# Altium schematic sheet MEMORY.schdoc
size D; SheetNumber: 6; SheetTotal: 8
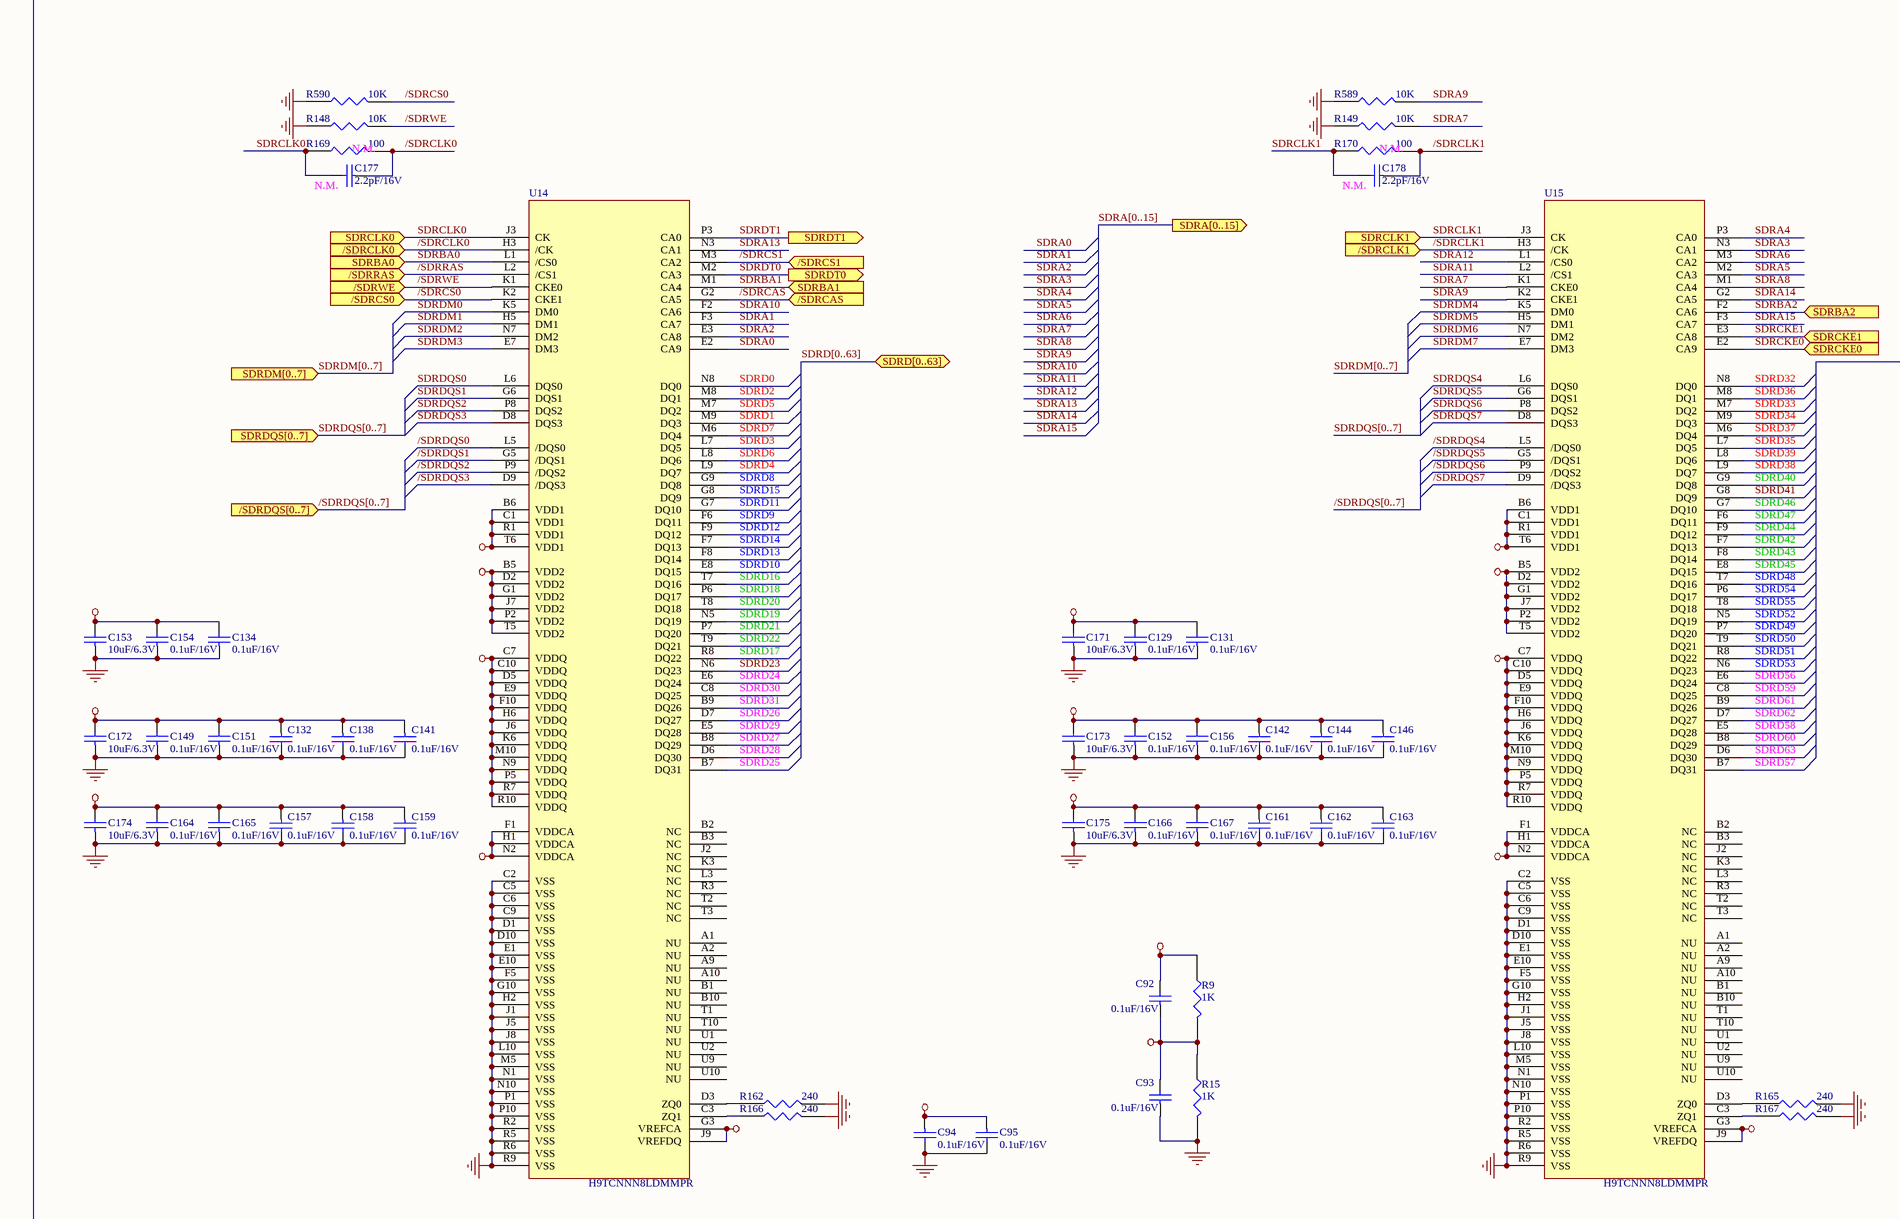
[diagram p0: MEMORY.schdoc, top left]
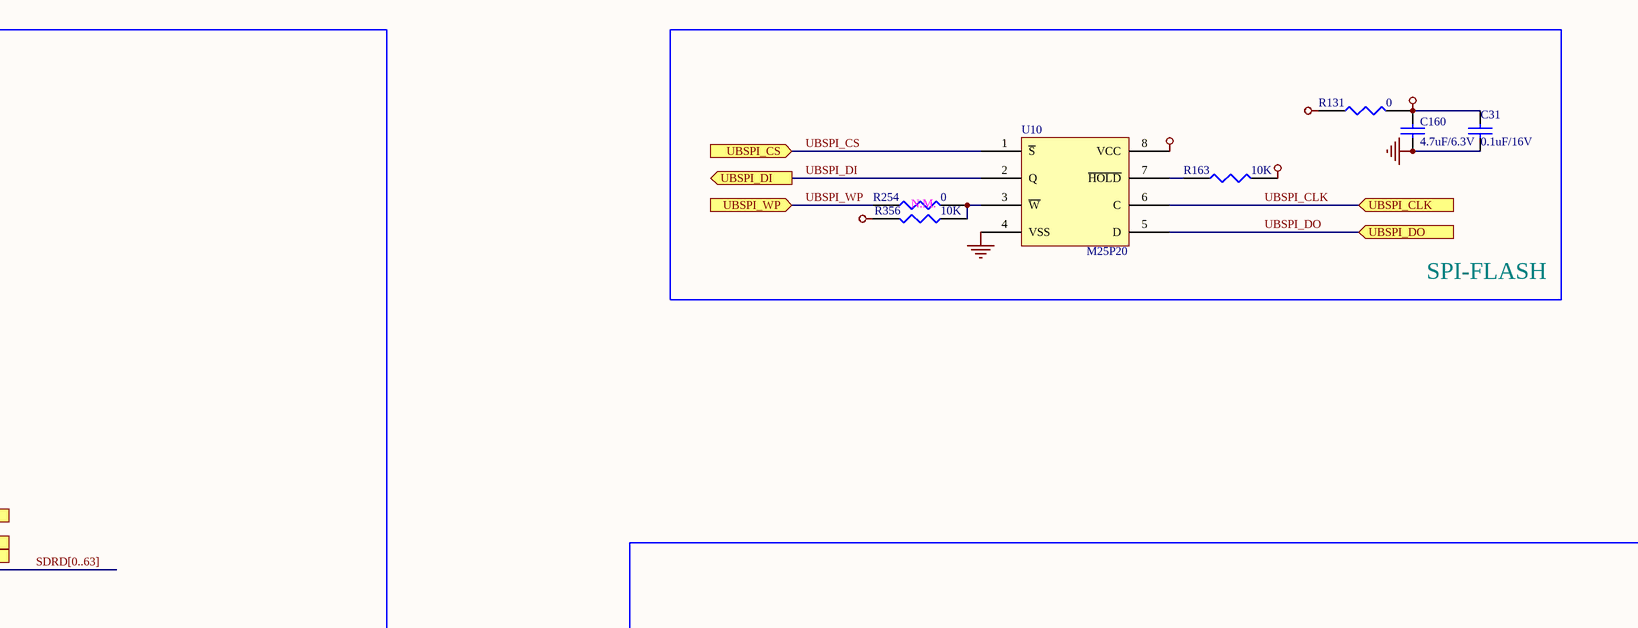
[diagram p1: MEMORY.schdoc, top right]
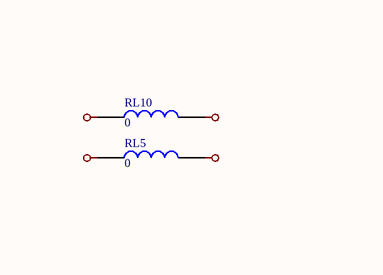
[diagram p2: MEMORY.schdoc, bottom left]
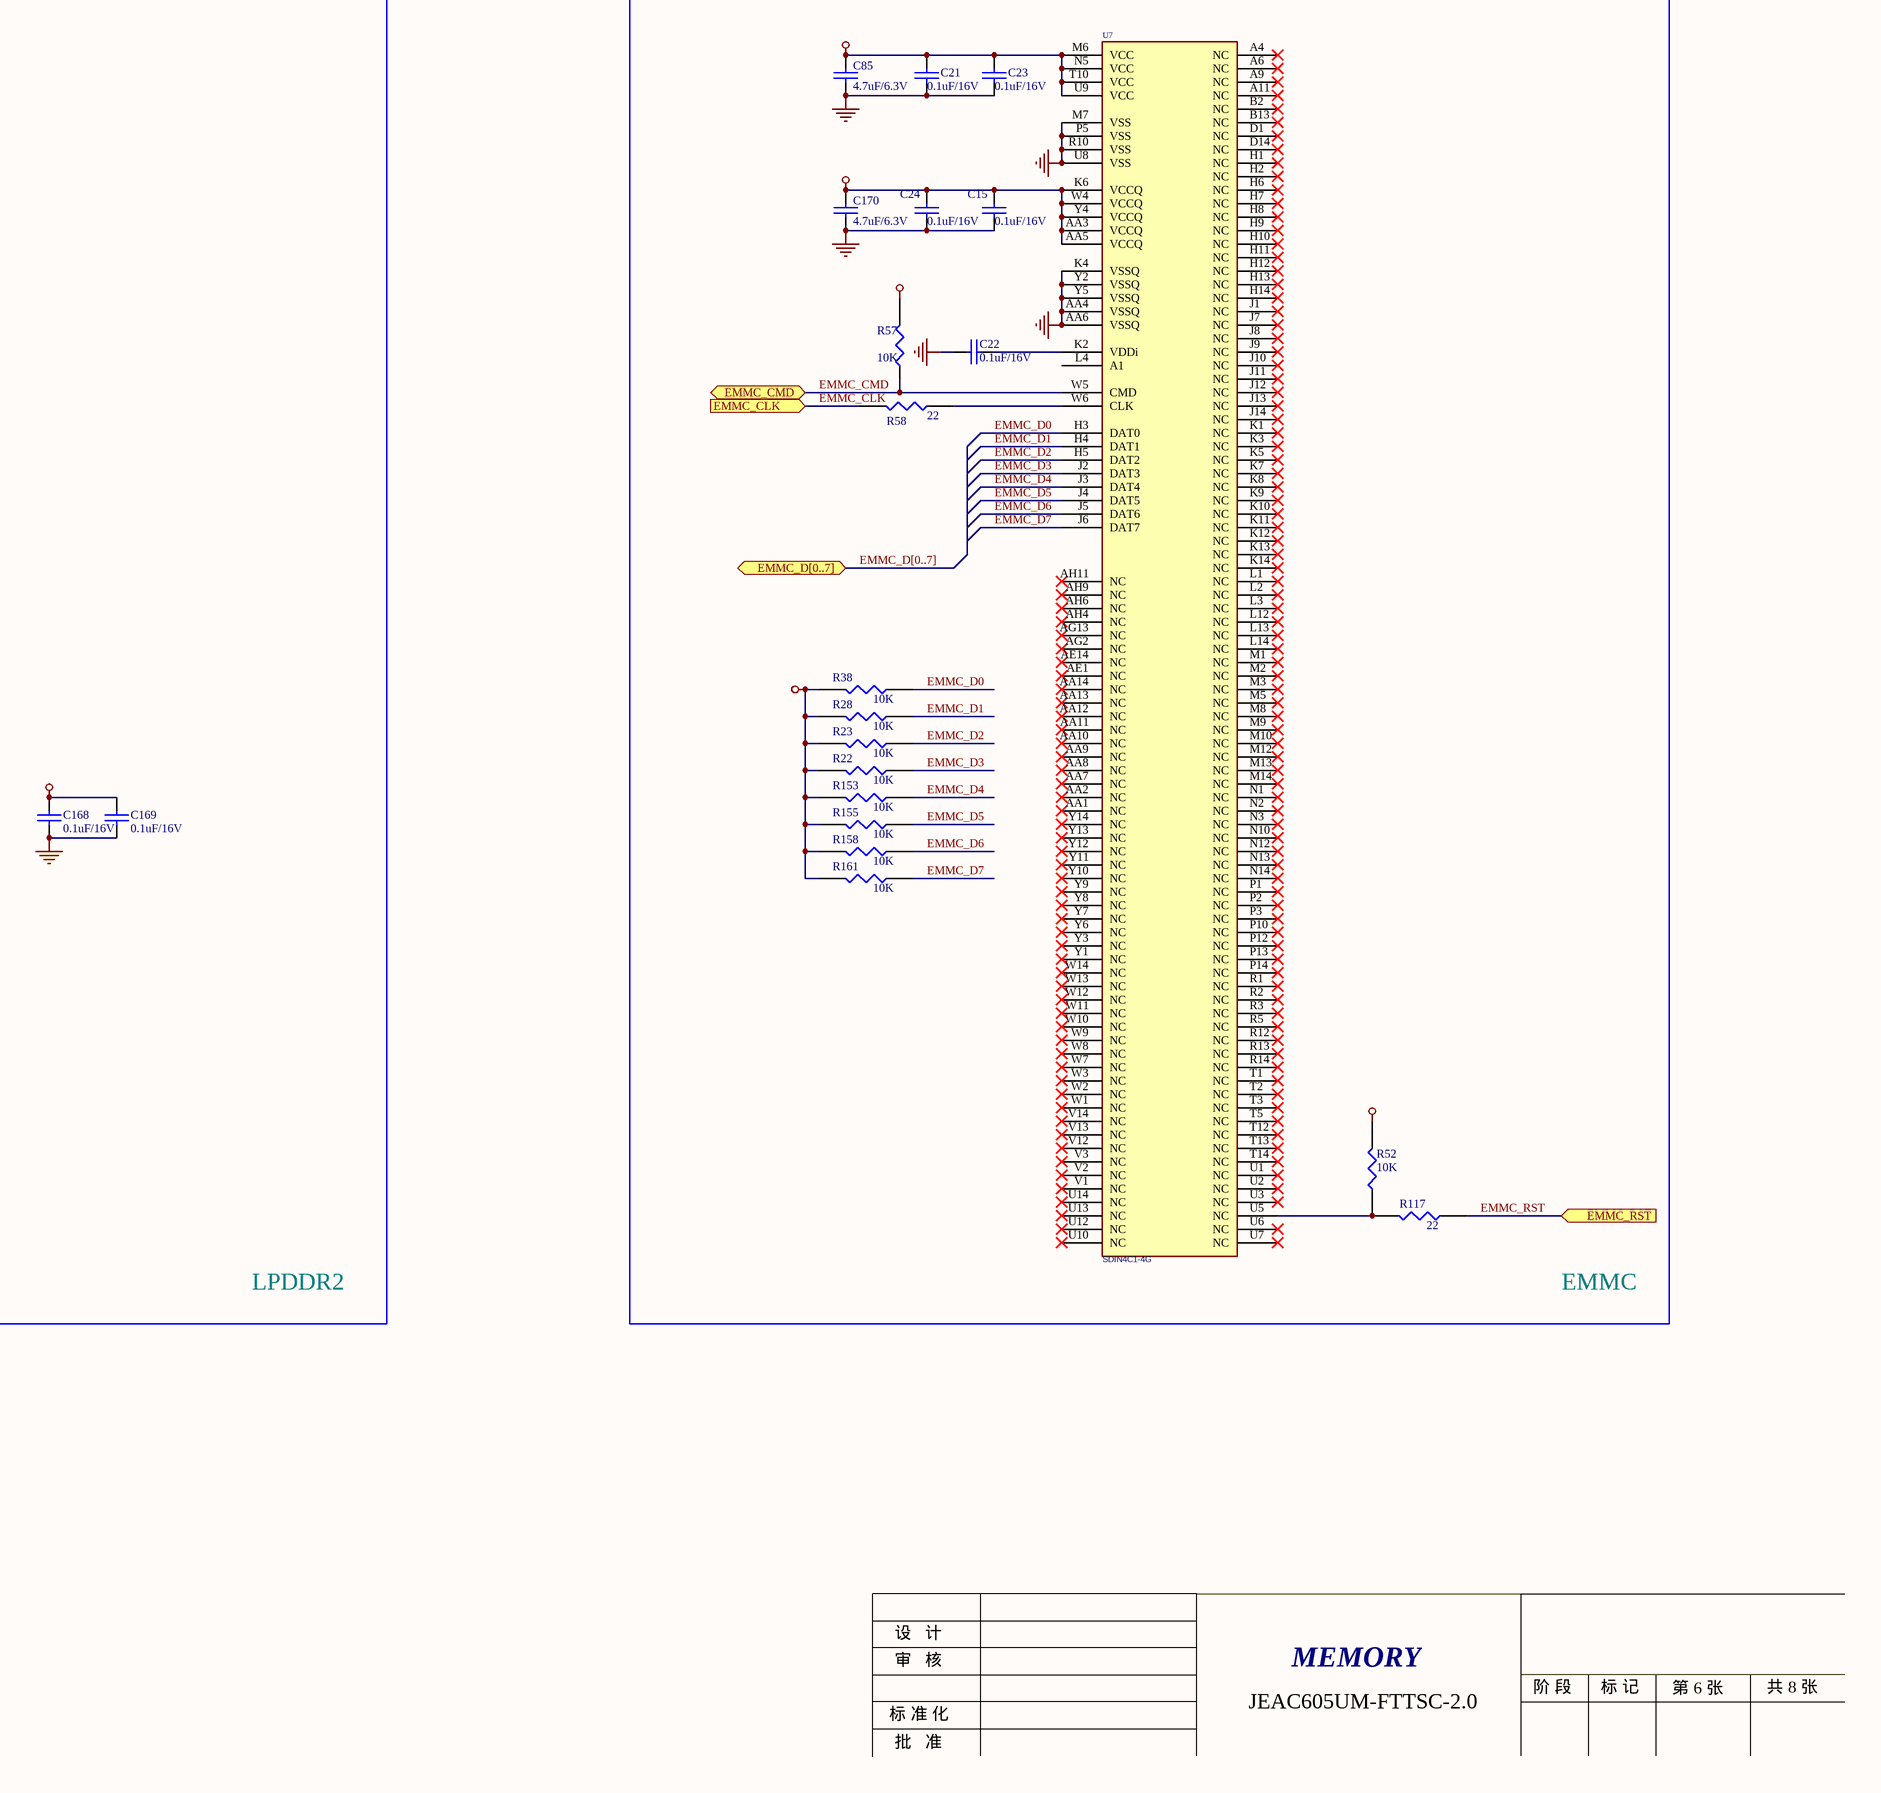
[diagram p3: MEMORY.schdoc, bottom right]

## Parts
C15  0.1uF/16V  [C0402]
C21  0.1uF/16V  [C0402]
C22  0.1uF/16V  [C0402]
C23  0.1uF/16V  [C0402]
C24  0.1uF/16V  [C0402]
C31  0.1uF/16V  [C0402]
C85  4.7uF/6.3V  [C0603]
C92  0.1uF/16V  [C0402]
C93  0.1uF/16V  [C0402]
C94  0.1uF/16V  [C0402]
C95  0.1uF/16V  [C0402]
C129  0.1uF/16V  [C0402]
C131  0.1uF/16V  [C0402]
C132  0.1uF/16V  [C0402]
C134  0.1uF/16V  [C0402]
C138  0.1uF/16V  [C0402]
C141  0.1uF/16V  [C0402]
C142  0.1uF/16V  [C0402]
C144  0.1uF/16V  [C0402]
C146  0.1uF/16V  [C0402]
C149  0.1uF/16V  [C0402]
C151  0.1uF/16V  [C0402]
C152  0.1uF/16V  [C0402]
C153  10uF/6.3V  [C0603]
C154  0.1uF/16V  [C0402]
C156  0.1uF/16V  [C0402]
C157  0.1uF/16V  [C0402]
C158  0.1uF/16V  [C0402]
C159  0.1uF/16V  [C0402]
C160  4.7uF/6.3V  [C0603]
C161  0.1uF/16V  [C0402]
C162  0.1uF/16V  [C0402]
C163  0.1uF/16V  [C0402]
C164  0.1uF/16V  [C0402]
C165  0.1uF/16V  [C0402]
C166  0.1uF/16V  [C0402]
C167  0.1uF/16V  [C0402]
C168  0.1uF/16V  [C0402]
C169  0.1uF/16V  [C0402]
C170  4.7uF/6.3V  [C0603]
C171  10uF/6.3V  [C0603]
C172  10uF/6.3V  [C0603]
C173  10uF/6.3V  [C0603]
C174  10uF/6.3V  [C0603]
C175  10uF/6.3V  [C0603]
C177  2.2pF/16V  [C0402]
C178  2.2pF/16V  [C0402]
R9  1K  [R0402]
R15  1K  [R0402]
R22  10K  [R0402]
R23  10K  [R0402]
R28  10K  [R0402]
R38  10K  [R0402]
R52  10K  [R0402]
R57  10K  [R0402]
R58  22  [R0402]
R117  22  [R0402]
R131  0  [R0402]
R148  10K  [R0402]
R149  10K  [R0402]
R153  10K  [R0402]
R155  10K  [R0402]
R158  10K  [R0402]
R161  10K  [R0402]
R162  240  [R0402]
R163  10K  [R0402]
R165  240  [R0402]
R166  240  [R0402]
R167  240  [R0402]
R169  100  [R0402]
R170  100  [R0402]
R254  0  [R0402]
R356  10K  [R0402]
R589  10K  [R0402]
R590  10K  [R0402]
RL5  0  [L0603]
RL10  0  [L0603]
U7  SDIN4C1-4G  [U-FBGA-169-0_5]
U10  M25P20  [U-SO-8-1_27]
U14  H9TCNNN8LDMMPR  [U-FBGA-134-0_65]
U15  H9TCNNN8LDMMPR  [U-FBGA-134-0_65]

## Blocks framed on the sheet
LPDDR2: C92-C95 C129 C131 C132 C134 C138 C141 C142 C144 C146 C149 C151-C154 C156-C159 C161-C169 C171-C175 C177 C178 R9 R15 R148 R149 R162 R165-R167 R169 R170 R589 R590 RL5 RL10 U14 U15
SPI-FLASH: C31 C160 R131 R163 R254 R356 U10
EMMC: C15 C21-C24 C85 C170 R22 R23 R28 R38 R52 R57 R58 R117 R153 R155 R158 R161 U7

## Ports
/SDRCAS (in), /SDRCLK0 (in), /SDRCLK1 (in), /SDRCS0 (in), /SDRCS1 (in), /SDRDQS[0..7] (in), /SDRRAS (in), /SDRWE (in), EMMC_CLK (in), EMMC_CMD (bidir), EMMC_D[0..7] (bidir), EMMC_RST (in), SDRA[0..15] (out), SDRBA0 (in), SDRBA1 (in), SDRBA2 (in), SDRCKE0 (in), SDRCKE1 (in), SDRCLK0 (in), SDRCLK1 (in), SDRD[0..63] (bidir), SDRDM[0..7] (in), SDRDQS[0..7] (in), SDRDT0 (out), SDRDT1 (out), UBSPI_CLK (in), UBSPI_CS (in), UBSPI_DI (out), UBSPI_DO (in), UBSPI_WP (in)

## Nets
DRAM_VREF: C92.1 C93.2 C94.1 C95.1 C168.1 C169.1 R9.2 R15.1 U14.G3(VREFCA) U14.J9(VREFDQ) U15.G3(VREFCA) U15.J9(VREFDQ)
GND: C15.1 C21.1 C22.1 C23.1 C24.1 C31.1 C85.2 C93.1 C94.2 C95.2 C129.1 C131.1 C132.2 C134.1 C138.2 C141.2 C142.2 C144.2 C146.2 C149.1 C151.1 C152.1 C153.1 C154.1 C156.1 C157.2 C158.2 C159.2 C160.2 C161.2 C162.2 C163.2 C164.1 C165.1 C166.1 C167.1 C168.2 C169.2 C170.2 C171.1 C172.1 C173.1 C174.1 C175.1 R15.2 R148.1 R149.1 R162.2 R165.2 R166.2 R167.2 R589.1 R590.1 U7.AA4(VSSQ) U7.AA6(VSSQ) U7.K4(VSSQ) U7.M7(VSS) U7.P5(VSS) U7.R10(VSS) U7.U8(VSS) U7.Y2(VSSQ) U7.Y5(VSSQ) U10.4(VSS) U14.C2(VSS) U14.C5(VSS) U14.C6(VSS) U14.C9(VSS) U14.D1(VSS) U14.D10(VSS) U14.E1(VSS) U14.E10(VSS) U14.F5(VSS) U14.G10(VSS) U14.H2(VSS) U14.J1(VSS) U14.J5(VSS) U14.J8(VSS) U14.L10(VSS) U14.M5(VSS) U14.N1(VSS) U14.N10(VSS) U14.P1(VSS) U14.P10(VSS) U14.R2(VSS) U14.R5(VSS) U14.R6(VSS) U14.R9(VSS) U15.C2(VSS) U15.C5(VSS) U15.C6(VSS) U15.C9(VSS) U15.D1(VSS) U15.D10(VSS) U15.E1(VSS) U15.E10(VSS) U15.F5(VSS) U15.G10(VSS) U15.H2(VSS) U15.J1(VSS) U15.J5(VSS) U15.J8(VSS) U15.L10(VSS) U15.M5(VSS) U15.N1(VSS) U15.N10(VSS) U15.P1(VSS) U15.P10(VSS) U15.R2(VSS) U15.R5(VSS) U15.R6(VSS) U15.R9(VSS)
VCC_1V8: RL5.2
VCC_3V: C15.2 C21.2 C23.2 C24.2 C85.1 C170.1 R22.2 R23.2 R28.2 R38.2 R52.2 R57.2 R131.1 R153.2 R155.2 R158.2 R161.2 U7.AA3(VCCQ) U7.AA5(VCCQ) U7.K6(VCCQ) U7.M6(VCC) U7.N5(VCC) U7.T10(VCC) U7.U9(VCC) U7.W4(VCCQ) U7.Y4(VCCQ)
VDD_DRAM_1.2V: C92.2 C132.1 C138.1 C141.1 C142.1 C144.1 C146.1 C149.2 C151.2 C152.2 C156.2 C157.1 C158.1 C159.1 C161.1 C162.1 C163.1 C164.2 C165.2 C166.2 C167.2 C172.2 C173.2 C174.2 C175.2 R9.1 RL10.1 U14.B5(VDD2) U14.C7(VDDQ) U14.C10(VDDQ) U14.D2(VDD2) U14.D5(VDDQ) U14.E9(VDDQ) U14.F1(VDDCA) U14.F10(VDDQ) U14.G1(VDD2) U14.H1(VDDCA) U14.H6(VDDQ) U14.J6(VDDQ) U14.J7(VDD2) U14.K6(VDDQ) U14.M10(VDDQ) U14.N2(VDDCA) U14.N9(VDDQ) U14.P2(VDD2) U14.P5(VDDQ) U14.R7(VDDQ) U14.R10(VDDQ) U14.T5(VDD2) U15.B5(VDD2) U15.C7(VDDQ) U15.C10(VDDQ) U15.D2(VDD2) U15.D5(VDDQ) U15.E9(VDDQ) U15.F1(VDDCA) U15.F10(VDDQ) U15.G1(VDD2) U15.H1(VDDCA) U15.H6(VDDQ) U15.J6(VDDQ) U15.J7(VDD2) U15.K6(VDDQ) U15.M10(VDDQ) U15.N2(VDDCA) U15.N9(VDDQ) U15.P2(VDD2) U15.P5(VDDQ) U15.R7(VDDQ) U15.R10(VDDQ) U15.T5(VDD2)
VDD_DRAM_1.8V: C129.2 C131.2 C134.2 C153.2 C154.2 C171.2 RL5.1 U14.B6(VDD1) U14.C1(VDD1) U14.R1(VDD1) U14.T6(VDD1) U15.B6(VDD1) U15.C1(VDD1) U15.R1(VDD1) U15.T6(VDD1)
VDD_SDR_1.2V: RL10.2
VDD_UBSPI: C31.2 C160.1 R131.2 R163.2 R356.2 U10.8(VCC)
/SDRCAS: U14.G2(CA5) ; port /SDRCAS
/SDRCLK0: C177.1 R169.2 U14.H3(/CK) ; port /SDRCLK0
/SDRCLK1: C178.1 R170.2 U15.H3(/CK) ; port /SDRCLK1
/SDRCS0: R590.2 U14.K2(CKE1) ; port /SDRCS0
/SDRCS1: U14.M3(CA2) ; port /SDRCS1
/SDRDQS0: U14.L5(/DQS0)
/SDRDQS1: U14.G5(/DQS1)
/SDRDQS2: U14.P9(/DQS2)
/SDRDQS3: U14.D9(/DQS3)
/SDRDQS4: U15.L5(/DQS0)
/SDRDQS5: U15.G5(/DQS1)
/SDRDQS6: U15.P9(/DQS2)
/SDRDQS7: U15.D9(/DQS3)
/SDRRAS: U14.L2(/CS1) ; port /SDRRAS
/SDRWE: R148.2 U14.K1(CKE0) ; port /SDRWE
EMMC_CLK: R58.2 ; port EMMC_CLK
EMMC_CMD: R57.1 U7.W5(CMD) ; port EMMC_CMD
EMMC_D0: R38.1 U7.H3(DAT0)
EMMC_D1: R28.1 U7.H4(DAT1)
EMMC_D2: R23.1 U7.H5(DAT2)
EMMC_D3: R22.1 U7.J2(DAT3)
EMMC_D4: R153.1 U7.J3(DAT4)
EMMC_D5: R155.1 U7.J4(DAT5)
EMMC_D6: R158.1 U7.J5(DAT6)
EMMC_D7: R161.1 U7.J6(DAT7)
EMMC_RST: R117.1 ; port EMMC_RST
SDRA0: U14.E2(CA9)
SDRA1: U14.F3(CA7)
SDRA2: U14.E3(CA8)
SDRA3: U15.N3(CA1)
SDRA4: U15.P3(CA0)
SDRA5: U15.M2(CA3)
SDRA6: U15.M3(CA2)
SDRA7: R149.2 U15.K1(CKE0)
SDRA8: U15.M1(CA4)
SDRA9: R589.2 U15.K2(CKE1)
SDRA10: U14.F2(CA6)
SDRA11: U15.L2(/CS1)
SDRA12: U15.L1(/CS0)
SDRA13: U14.N3(CA1)
SDRA14: U15.G2(CA5)
SDRA15: U15.F3(CA7)
SDRBA0: U14.L1(/CS0) ; port SDRBA0
SDRBA1: U14.M1(CA4) ; port SDRBA1
SDRBA2: U15.F2(CA6) ; port SDRBA2
SDRCKE0: U15.E2(CA9) ; port SDRCKE0
SDRCKE1: U15.E3(CA8) ; port SDRCKE1
SDRCLK0: C177.2 R169.1 U14.J3(CK) ; port SDRCLK0
SDRCLK1: C178.2 R170.1 U15.J3(CK) ; port SDRCLK1
SDRD0: U14.N8(DQ0)
SDRD1: U14.M9(DQ3)
SDRD2: U14.M8(DQ1)
SDRD3: U14.L7(DQ5)
SDRD4: U14.L9(DQ7)
SDRD5: U14.M7(DQ2)
SDRD6: U14.L8(DQ6)
SDRD7: U14.M6(DQ4)
SDRD8: U14.G9(DQ8)
SDRD9: U14.F6(DQ11)
SDRD10: U14.E8(DQ15)
SDRD11: U14.G7(DQ10)
SDRD12: U14.F9(DQ12)
SDRD13: U14.F8(DQ14)
SDRD14: U14.F7(DQ13)
SDRD15: U14.G8(DQ9)
SDRD16: U14.T7(DQ16)
SDRD17: U14.R8(DQ22)
SDRD18: U14.P6(DQ17)
SDRD19: U14.N5(DQ19)
SDRD20: U14.T8(DQ18)
SDRD21: U14.P7(DQ20)
SDRD22: U14.T9(DQ21)
SDRD23: U14.N6(DQ23)
SDRD24: U14.E6(DQ24)
SDRD25: U14.B7(DQ31)
SDRD26: U14.D7(DQ27)
SDRD27: U14.B8(DQ29)
SDRD28: U14.D6(DQ30)
SDRD29: U14.E5(DQ28)
SDRD30: U14.C8(DQ25)
SDRD31: U14.B9(DQ26)
SDRD32: U15.N8(DQ0)
SDRD33: U15.M7(DQ2)
SDRD34: U15.M9(DQ3)
SDRD35: U15.L7(DQ5)
SDRD36: U15.M8(DQ1)
SDRD37: U15.M6(DQ4)
SDRD38: U15.L9(DQ7)
SDRD39: U15.L8(DQ6)
SDRD40: U15.G9(DQ8)
SDRD41: U15.G8(DQ9)
SDRD42: U15.F7(DQ13)
SDRD43: U15.F8(DQ14)
SDRD44: U15.F9(DQ12)
SDRD45: U15.E8(DQ15)
SDRD46: U15.G7(DQ10)
SDRD47: U15.F6(DQ11)
SDRD48: U15.T7(DQ16)
SDRD49: U15.P7(DQ20)
SDRD50: U15.T9(DQ21)
SDRD51: U15.R8(DQ22)
SDRD52: U15.N5(DQ19)
SDRD53: U15.N6(DQ23)
SDRD54: U15.P6(DQ17)
SDRD55: U15.T8(DQ18)
SDRD56: U15.E6(DQ24)
SDRD57: U15.B7(DQ31)
SDRD58: U15.E5(DQ28)
SDRD59: U15.C8(DQ25)
SDRD60: U15.B8(DQ29)
SDRD61: U15.B9(DQ26)
SDRD62: U15.D7(DQ27)
SDRD63: U15.D6(DQ30)
SDRDM0: U14.K5(DM0)
SDRDM1: U14.H5(DM1)
SDRDM2: U14.N7(DM2)
SDRDM3: U14.E7(DM3)
SDRDM4: U15.K5(DM0)
SDRDM5: U15.H5(DM1)
SDRDM6: U15.N7(DM2)
SDRDM7: U15.E7(DM3)
SDRDQS0: U14.L6(DQS0)
SDRDQS1: U14.G6(DQS1)
SDRDQS2: U14.P8(DQS2)
SDRDQS3: U14.D8(DQS3)
SDRDQS4: U15.L6(DQS0)
SDRDQS5: U15.G6(DQS1)
SDRDQS6: U15.P8(DQS2)
SDRDQS7: U15.D8(DQS3)
SDRDT0: U14.M2(CA3) ; port SDRDT0
SDRDT1: U14.P3(CA0) ; port SDRDT1
UBSPI_CLK: U10.6(C) ; port UBSPI_CLK
UBSPI_CS: U10.1(~{S}) ; port UBSPI_CS
UBSPI_DI: U10.2(Q) ; port UBSPI_DI
UBSPI_DO: U10.5(D) ; port UBSPI_DO
UBSPI_WP: R254.1 ; port UBSPI_WP
NetC22_2: C22.2 U7.K2(VDDi)
NetR52_1: R52.1 R117.2 U7.U5(NC)
NetR58_1: R58.1 U7.W6(CLK)
NetR162_1: R162.1 U14.D3(ZQ0)
NetR163_1: R163.1 U10.7(~{HOLD})
NetR165_1: R165.1 U15.D3(ZQ0)
NetR166_1: R166.1 U14.C3(ZQ1)
NetR167_1: R167.1 U15.C3(ZQ1)
NetR254_2: R254.2 R356.1 U10.3(~{W})

Not connected (* = marked no-connect by the designer): U7 A4(NC)* A6(NC)* A9(NC)* A11(NC)* AA1(NC)* AA2(NC)* AA7(NC)* AA8(NC)* AA9(NC)* AA10(NC)* AA11(NC)* AA12(NC)* AA13(NC)* AA14(NC)* AE1(NC)* AE14(NC)* AG2(NC)* AG13(NC)* AH4(NC)* AH6(NC)* AH9(NC)* AH11(NC)* B2(NC)* B13(NC)* D1(NC)* D14(NC)* H1(NC)* H2(NC)* H6(NC)* H7(NC)* H8(NC)* H9(NC)* H10(NC)* H11(NC)* H12(NC)* H13(NC)* H14(NC)* J1(NC)* J7(NC)* J8(NC)* J9(NC)* J10(NC)* J11(NC)* J12(NC)* J13(NC)* J14(NC)* K1(NC)* K3(NC)* K5(NC)* K7(NC)* K8(NC)* K9(NC)* K10(NC)* K11(NC)* K12(NC)* K13(NC)* K14(NC)* L1(NC)* L2(NC)* L3(NC)* L4(A1) L12(NC)* L13(NC)* L14(NC)* M1(NC)* M2(NC)* M3(NC)* M5(NC)* M8(NC)* M9(NC)* M10(NC)* M12(NC)* M13(NC)* M14(NC)* N1(NC)* N2(NC)* N3(NC)* N10(NC)* N12(NC)* N13(NC)* N14(NC)* P1(NC)* P2(NC)* P3(NC)* P10(NC)* P12(NC)* P13(NC)* P14(NC)* R1(NC)* R2(NC)* R3(NC)* R5(NC)* R12(NC)* R13(NC)* R14(NC)* T1(NC)* T2(NC)* T3(NC)* T5(NC)* T12(NC)* T13(NC)* T14(NC)* U1(NC)* U2(NC)* U3(NC)* U6(NC)* U7(NC)* U10(NC)* U12(NC)* U13(NC)* U14(NC)* V1(NC)* V2(NC)* V3(NC)* V12(NC)* V13(NC)* V14(NC)* W1(NC)* W2(NC)* W3(NC)* W7(NC)* W8(NC)* W9(NC)* W10(NC)* W11(NC)* W12(NC)* W13(NC)* W14(NC)* Y1(NC)* Y3(NC)* Y6(NC)* Y7(NC)* Y8(NC)* Y9(NC)* Y10(NC)* Y11(NC)* Y12(NC)* Y13(NC)* Y14(NC)*; U14 A1(NU) A2(NU) A9(NU) A10(NU) B1(NU) B2(NC) B3(NC) B10(NU) J2(NC) K3(NC) L3(NC) R3(NC) T1(NU) T2(NC) T3(NC) T10(NU) U1(NU) U2(NU) U9(NU) U10(NU); U15 A1(NU) A2(NU) A9(NU) A10(NU) B1(NU) B2(NC) B3(NC) B10(NU) J2(NC) K3(NC) L3(NC) R3(NC) T1(NU) T2(NC) T3(NC) T10(NU) U1(NU) U2(NU) U9(NU) U10(NU)

## Buses and harness runs
bus /SDRDQS[0..7]
bus /SDRDQS[0..7] = port /SDRDQS[0..7]
bus EMMC_D[0..7] = port EMMC_D[0..7]
bus SDRA[0..15] = port SDRA[0..15]
bus SDRD[0..63]
bus SDRD[0..63] = port SDRD[0..63]
bus SDRDM[0..7]
bus SDRDM[0..7] = port SDRDM[0..7]
bus SDRDQS[0..7]
bus SDRDQS[0..7] = port SDRDQS[0..7]

## Notes on the sheet
- (near R254) N.M.
- (near C177) N.M.
- (near R169) N.M.
- (near C178) N.M.
- (near R170) N.M.
- 设   计
- 审   核
- MEMORY
- 标 准 化
- 批   准
- JEAC605UM-FTTSC-2.0
- 阶 段
- 标 记
- 第 6 张
- 共 8 张

## Library data of the parts
C15 C21-C24 C31 C85 C92-C95 C129 C131 C132 C134 C138 C141 C142 C144 C146 C149 C151-C154 C156-C175 C177 C178 = CAP: Capacitor
R9 R15 R22 R23 R28 R38 R52 R57 R58 R117 R131 R148 R149 R153 R155 R158 R161-R163 R165-R167 R169 R170 R254 R356 R589 R590 = RES1
RL5 RL10 = INDUCTOR
U7 = SDIN3C2-16G
U10 = A25L80P
U14 U15 = EDB8132B2MA